# EAGLE schematic PMM (EAGLE 7.1.0)
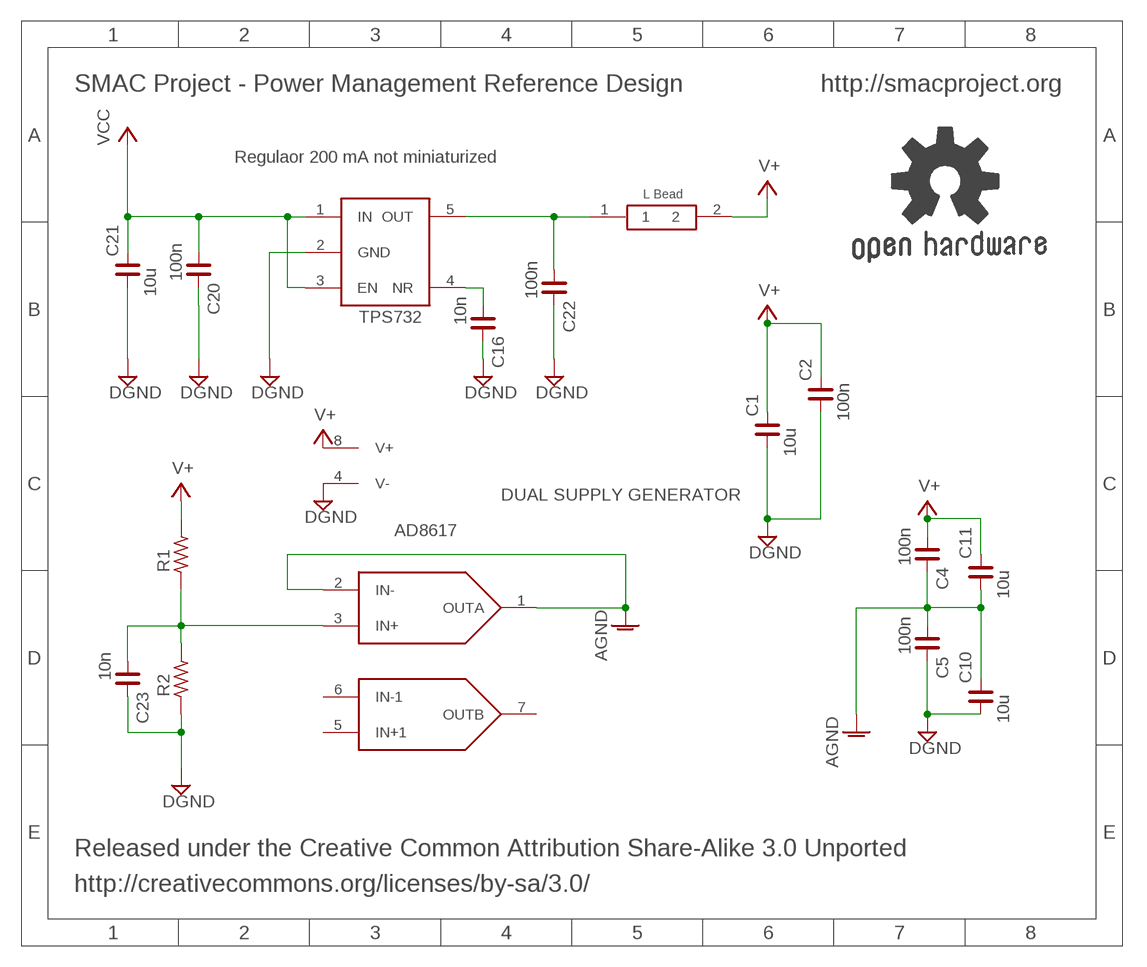
[diagram p0: schematic, sheet 1]

## Parts
C1  10u  C_0402  [C0402]
C2  100n  C_0402  [C0402]
C4  100n  C_0402  [C0402]
C5  100n  C_0402  [C0402]
C10  10u  C_0402  [C0402]
C11  10u  C_0402  [C0402]
C16  10n  C_0402  [C0402]
C20  100n  C_0402  [C0402]
C21  10u  C_0402  [C0402]
C22  100n  C_0402  [C0402]
C23  10n  C_0402  [C0402]
GOLD_ORB_SM1  OSHWLOGO_REF_SM  [OSHW2REF]
IC1  TPS732XX  [SOT23]
IC2  AD8617  [MSOP8]
L-BEAD  L-BEAD  [0402]
R1  R_0402  [R0402]
R2  R_0402  [R0402]

## Nets
AGND: C4.2 C5.1 C10.2 C11.1 IC2.1(OUTA) IC2.2(IN-)
DGND: C1.1 C2.1 C5.2 C10.1 C16.2 C20.2 C21.1 C22.2 C23.2 IC1.2(GND) IC2.4(V-) R2.1
N$2: C23.1 IC2.3(IN+) R1.1 R2.2
N$20: C16.1 IC1.4(NR)
N$21: C22.1 IC1.5(OUT) L-BEAD.1
V+: C1.2 C2.2 C4.1 C11.2 IC2.8(V+) L-BEAD.2 R1.2
VCC: C20.1 C21.2 IC1.1(IN) IC1.3(EN)
Unconnected: IC2.5(IN+1) IC2.6(IN-1) IC2.7(OUTB)

## Notes on the sheet
- SMAC Project - Power Management Reference Design | http://smacproject.org
- Regulaor 200 mA not miniaturized
- DUAL SUPPLY GENERATOR
- Released under the Creative Common Attribution Share-Alike 3.0 Unported
- http://creativecommons.org/licenses/by-sa/3.0/

## Library data of the parts
C1 C2 C4 C5 C10 C11 C16 C20-C23 = rc-master-smd:C_: NON-POLARIZED CAP
GOLD_ORB_SM1 = bfl:OSHWLOGO: These are Open-Source Hardware logos.
IC1 = TPS732xx:TPS732XX
IC2 = ad8617:AD8617
L-BEAD = L-Bead:L-BEAD
R1 R2 = rc-master-smd:R_: RESISTOR